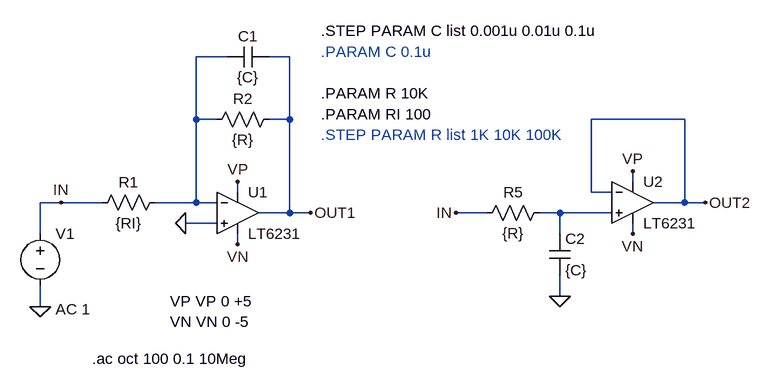
[diagram p0: schematic Fig_8-12_LowPass_Filter_AC.asc]
Fig_8-12_LowPass_Filter_AC.asc, the LTspice schematic file:
Version 4
SHEET 1 1016 680
WIRE 160 -96 112 -96
WIRE 256 -96 224 -96
WIRE 112 0 112 -96
WIRE 144 0 112 0
WIRE 256 0 256 -96
WIRE 256 0 224 0
WIRE 864 0 720 0
WIRE 784 96 784 80
WIRE 176 112 176 96
WIRE 720 112 720 0
WIRE 752 112 720 112
WIRE -96 128 -128 128
WIRE -32 128 -96 128
WIRE 112 128 112 0
WIRE 112 128 48 128
WIRE 144 128 112 128
WIRE 864 128 864 0
WIRE 864 128 816 128
WIRE 896 128 864 128
WIRE 256 144 256 0
WIRE 256 144 208 144
WIRE 288 144 256 144
WIRE 560 144 512 144
WIRE 672 144 640 144
WIRE 752 144 672 144
WIRE 144 160 96 160
WIRE -128 176 -128 128
WIRE 672 176 672 144
WIRE 784 176 784 160
WIRE 176 192 176 176
WIRE 672 272 672 240
WIRE -128 288 -128 256
FLAG 176 96 VP
FLAG 176 192 VN
FLAG 96 160 0
FLAG 288 144 OUT1
FLAG -128 288 0
FLAG -96 128 IN
FLAG 784 80 VP
FLAG 784 176 VN
FLAG 896 128 OUT2
FLAG 512 144 IN
FLAG 672 272 0
SYMBOL res -48 144 R270
WINDOW 0 32 56 VTop 2
WINDOW 3 0 56 VBottom 2
SYMATTR InstName R1
SYMATTR Value {RI}
SYMBOL res 128 16 R270
WINDOW 0 32 56 VTop 2
WINDOW 3 0 56 VBottom 2
SYMATTR InstName R2
SYMATTR Value {R}
SYMBOL voltage -128 160 R0
WINDOW 123 24 132 Left 2
WINDOW 39 0 0 Left 2
SYMATTR Value2 AC 1
SYMATTR InstName V1
SYMATTR Value ""
SYMBOL cap 160 -80 R270
WINDOW 0 32 32 VTop 2
WINDOW 3 0 32 VBottom 2
SYMATTR InstName C1
SYMATTR Value {C}
SYMBOL res 544 160 R270
WINDOW 0 32 56 VTop 2
WINDOW 3 0 56 VBottom 2
SYMATTR InstName R5
SYMATTR Value {R}
SYMBOL cap 656 176 R0
SYMATTR InstName C2
SYMATTR Value {C}
SYMBOL Opamps\\LT6231 176 144 R0
SYMATTR InstName U1
SYMBOL Opamps\\LT6231 784 128 R0
SYMATTR InstName U2
TEXT 72 280 Left 2 !VP VP 0 +5\nVN VN 0 -5
TEXT -48 368 Left 2 !.ac oct 100 0.1 10Meg
TEXT 304 -136 Left 2 !.STEP PARAM C list 0.001u 0.01u 0.1u
TEXT 304 -40 Left 2 !.PARAM R 10K
TEXT 304 -8 Left 2 !.PARAM RI 100
TEXT 304 -104 Left 2 ;.PARAM C 0.1u
TEXT 304 24 Left 2 ;.STEP PARAM R list 1K 10K 100K

The netlist it stands for:
* Fig_8-12_LowPass_Filter_AC.asc
R1 IN N001 {RI}
R2 N001 OUT1 {R}
V1 IN 0 AC 1
C1 N001 OUT1 {C}
R5 IN N002 {R}
C2 N002 0 {C}
XU1 0 N001 OUT1 VP VN LT6231  ; pins In+ In- OUT V+ V-
XU2 N002 OUT2 OUT2 VP VN LT6231  ; pins In+ In- OUT V+ V-
VP VP 0 +5
VN VN 0 -5
.ac oct 100 0.1 10Meg
.STEP PARAM C list 0.001u 0.01u 0.1u
.PARAM R 10K
.PARAM RI 100
* .PARAM C 0.1u
* .STEP PARAM R list 1K 10K 100K
.lib LTC2.lib
.backanno
.end